# EAGLE schematic wclock (EAGLE 6.0)
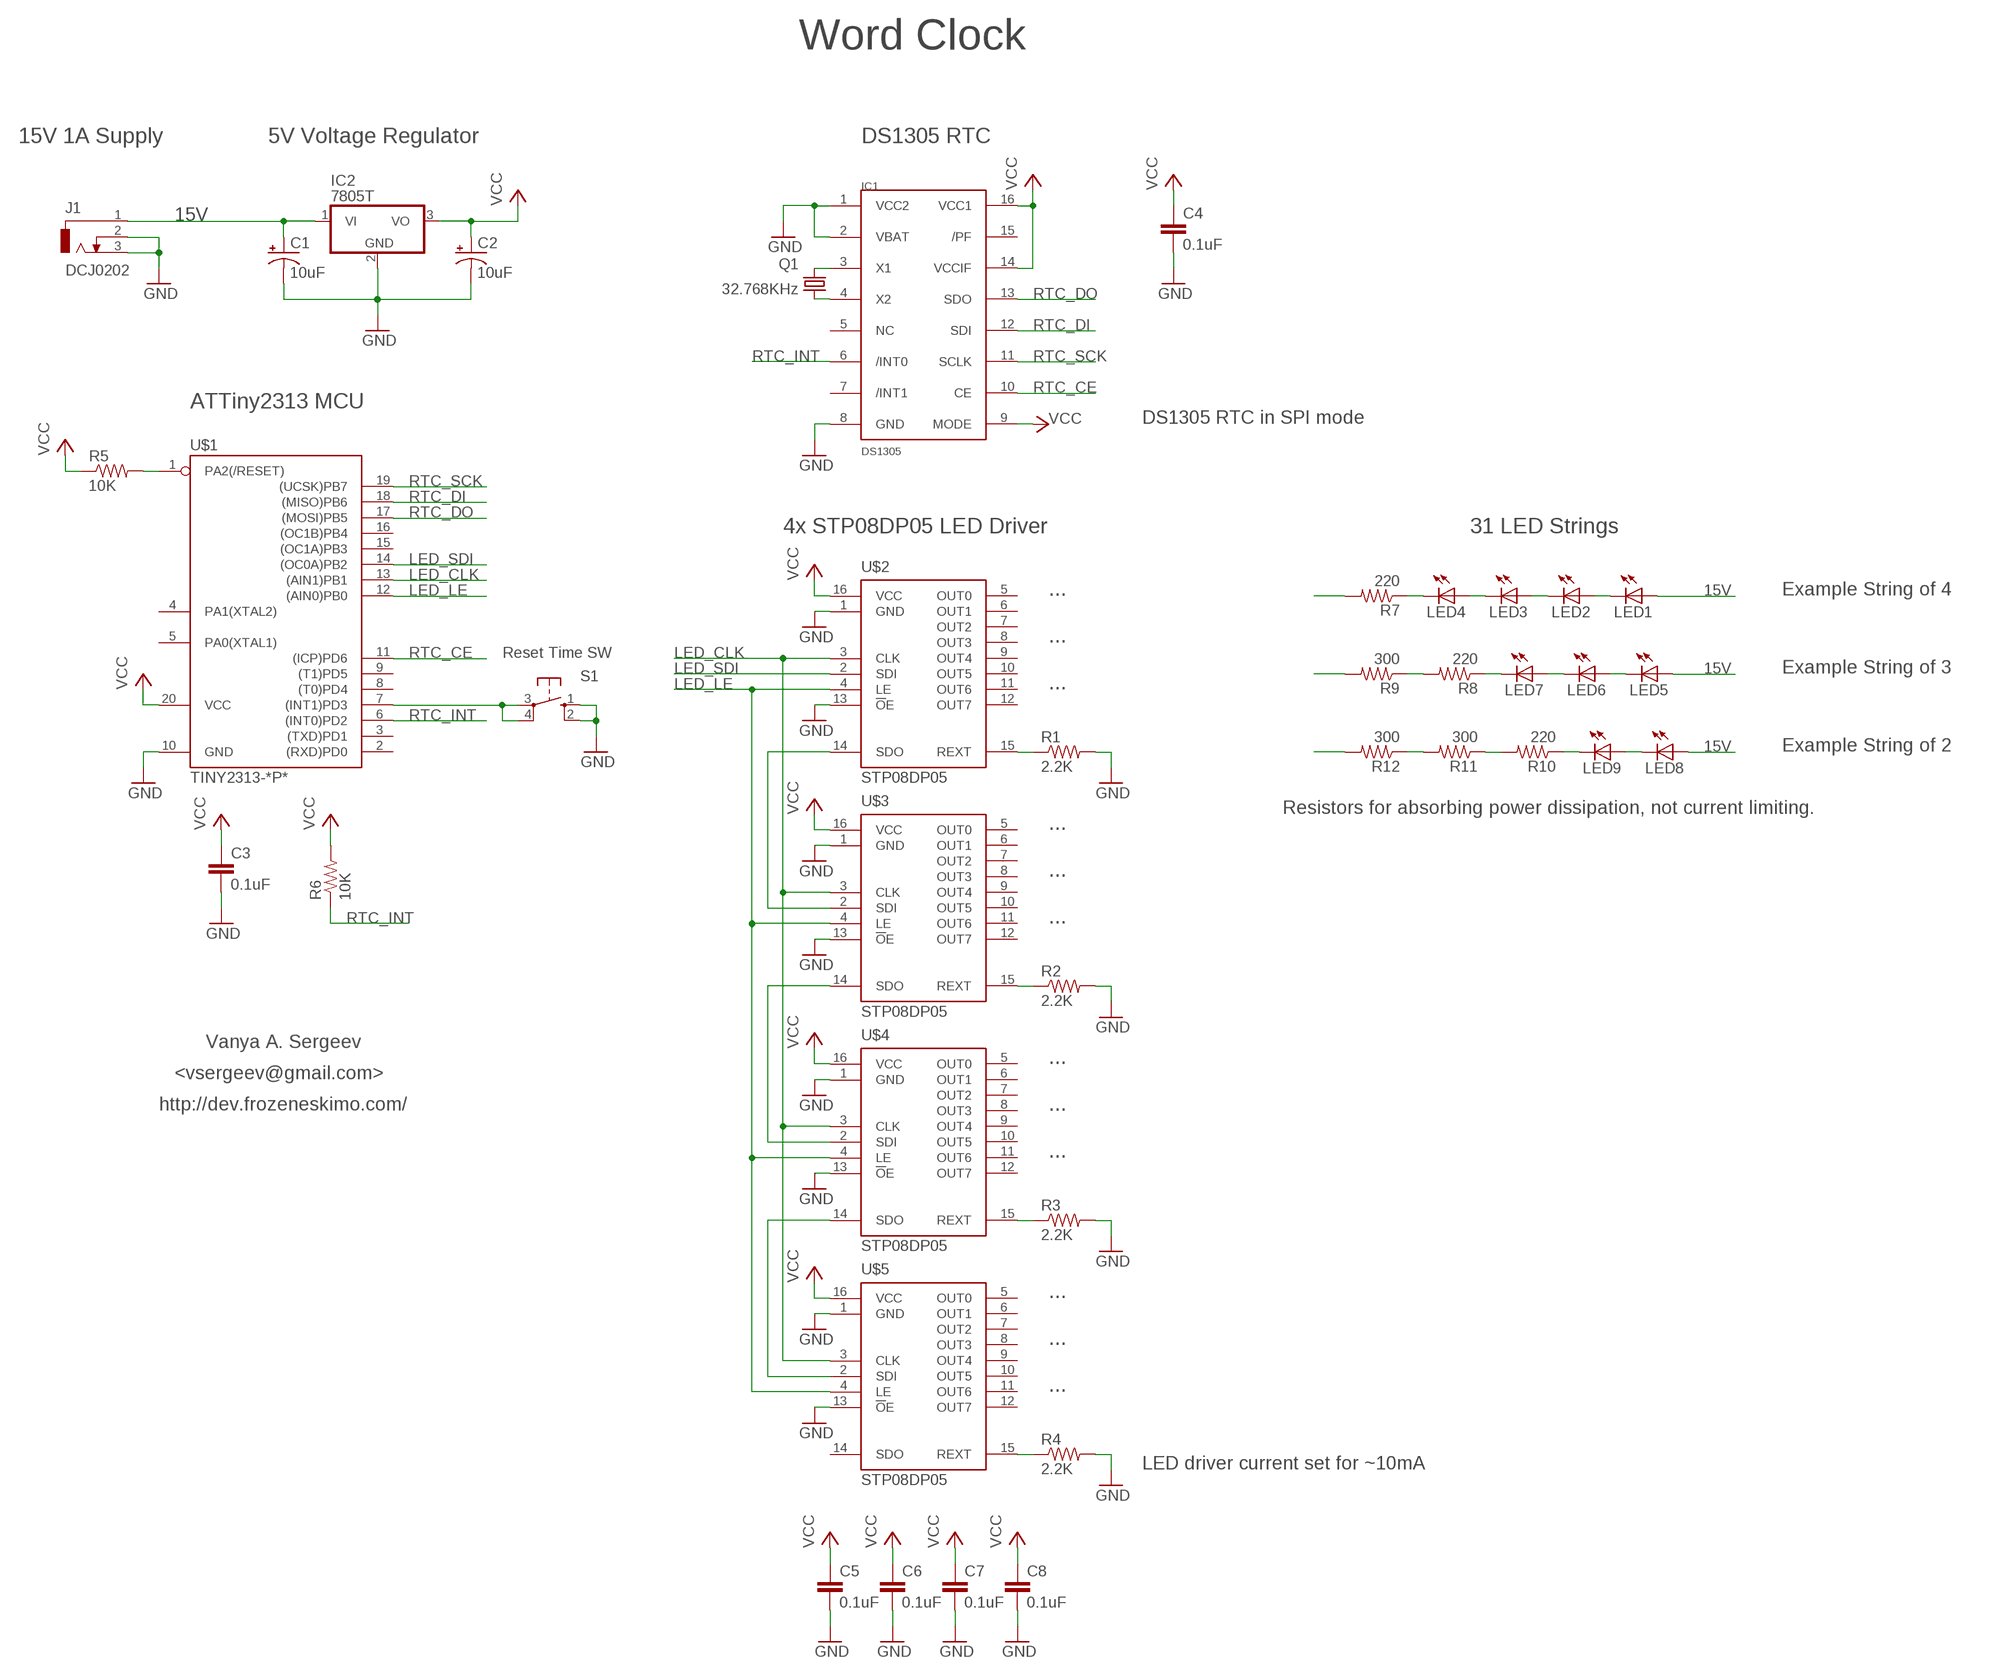
[diagram p0: schematic, sheet 1]

## Parts
C1  10uF  CPOL-USE2.5-5  [E2,5-5]
C2  10uF  CPOL-USE2.5-5  [E2,5-5]
C3  0.1uF  C-EU025-025X050  [C025-025X050]
C4  0.1uF  C-EU025-025X050  [C025-025X050]
C5  0.1uF  C-EU025-025X050  [C025-025X050]
C6  0.1uF  C-EU025-025X050  [C025-025X050]
C7  0.1uF  C-EU025-025X050  [C025-025X050]
C8  0.1uF  C-EU025-025X050  [C025-025X050]
IC1  DS1305  [DIL16]
IC2  7805T  [TO220H]
J1  DCJ0202  [DCJ0202]
LED1  LED5MM  [LED5MM]
LED2  LED5MM  [LED5MM]
LED3  LED5MM  [LED5MM]
LED4  LED5MM  [LED5MM]
LED5  LED5MM  [LED5MM]
LED6  LED5MM  [LED5MM]
LED7  LED5MM  [LED5MM]
LED8  LED5MM  [LED5MM]
LED9  LED5MM  [LED5MM]
Q1  32.768KHz  CRYSTALTC26V  [TC26V]
R1  2.2K  R-US_0207/10  [0207/10]
R2  2.2K  R-US_0207/10  [0207/10]
R3  2.2K  R-US_0207/10  [0207/10]
R4  2.2K  R-US_0207/10  [0207/10]
R5  10K  R-US_0207/10  [0207/10]
R6  10K  R-US_0207/10  [0207/10]
R7  220  R-US_0207/10  [0207/10]
R8  220  R-US_0207/10  [0207/10]
R9  300  R-US_0207/10  [0207/10]
R10  220  R-US_0207/10  [0207/10]
R11  300  R-US_0207/10  [0207/10]
R12  300  R-US_0207/10  [0207/10]
S1  10-XX  [B3F-10XX]
U$1  TINY2313-*P*  [DIL20]
U$2  STP08DP05  [DIL16]
U$3  STP08DP05  [DIL16]
U$4  STP08DP05  [DIL16]
U$5  STP08DP05  [DIL16]

## Nets
15V: C1.+ IC2.1(VI) J1.1 LED1.A LED5.A LED8.A
GND: C1.- C2.- C3.2 C4.2 C5.2 C6.2 C7.2 C8.2 IC1.1(VCC2) IC1.2(VBAT) IC1.8(GND) IC2.2(GND) J1.2 J1.3 R1.2 R2.2 R3.2 R4.2 S1.1(S) S1.2(S1) U$1.10(GND) U$2.1(GND) U$2.13(!O!E) U$3.1(GND) U$3.13(!O!E) U$4.1(GND) U$4.13(!O!E) U$5.1(GND) U$5.13(!O!E)
LED_CLK: U$1.13((AIN1)PB1) U$2.3(CLK) U$3.3(CLK) U$4.3(CLK) U$5.3(CLK)
LED_LE: U$1.12((AIN0)PB0) U$2.4(LE) U$3.4(LE) U$4.4(LE) U$5.4(LE)
LED_SDI: U$1.14((OC0A)PB2) U$2.2(SDI)
N$1: R10.2 R11.1
N$2: IC1.3(X1) Q1.2
N$3: IC1.4(X2) Q1.1
N$4: R1.1 U$2.15(REXT)
N$5: R2.1 U$3.15(REXT)
N$6: U$2.14(SDO) U$3.2(SDI)
N$7: U$3.14(SDO) U$4.2(SDI)
N$8: U$4.14(SDO) U$5.2(SDI)
N$9: R3.1 U$4.15(REXT)
N$10: R4.1 U$5.15(REXT)
N$11: R5.2 U$1.1(PA2(/RESET))
N$12: LED4.K(C) R7.1
N$13: R8.2 R9.1
N$14: R7.2
N$15: R9.2
N$16: R12.2
N$17: LED1.K(C) LED2.A
N$18: LED2.K(C) LED3.A
N$19: S1.3(P) S1.4(P1) U$1.7((INT1)PD3)
N$20: LED3.K(C) LED4.A
N$21: LED7.K(C) R8.1
N$22: LED6.K(C) LED7.A
N$23: LED5.K(C) LED6.A
N$24: LED8.K(C) LED9.A
N$25: LED9.K(C) R10.1
N$26: R11.2 R12.1
RTC_CE: IC1.10(CE) U$1.11((ICP)PD6)
RTC_DI: IC1.12(SDI) U$1.18((MISO)PB6)
RTC_DO: IC1.13(SDO) U$1.17((MOSI)PB5)
RTC_INT: IC1.6(/INT0) R6.1 U$1.6((INT0)PD2)
RTC_SCK: IC1.11(SCLK) U$1.19((UCSK)PB7)
VCC: C2.+ C3.1 C4.1 C5.1 C6.1 C7.1 C8.1 IC1.9(MODE) IC1.14(VCCIF) IC1.16(VCC1) IC2.3(VO) R5.1 R6.2 U$1.20(VCC) U$2.16(VCC) U$3.16(VCC) U$4.16(VCC) U$5.16(VCC)
Unconnected: IC1.5(NC) IC1.7(/INT1) IC1.15(/PF) U$1.2((RXD)PD0) U$1.3((TXD)PD1) U$1.4(PA1(XTAL2)) U$1.5(PA0(XTAL1)) U$1.8((T0)PD4) U$1.9((T1)PD5) U$1.15((OC1A)PB3) U$1.16((OC1B)PB4) U$2.5(OUT0) U$2.6(OUT1) U$2.7(OUT2) U$2.8(OUT3) U$2.9(OUT4) U$2.10(OUT5) U$2.11(OUT6) U$2.12(OUT7) U$3.5(OUT0) U$3.6(OUT1) U$3.7(OUT2) U$3.8(OUT3) U$3.9(OUT4) U$3.10(OUT5) U$3.11(OUT6) U$3.12(OUT7) U$4.5(OUT0) U$4.6(OUT1) U$4.7(OUT2) U$4.8(OUT3) U$4.9(OUT4) U$4.10(OUT5) U$4.11(OUT6) U$4.12(OUT7) U$5.5(OUT0) U$5.6(OUT1) U$5.7(OUT2) U$5.8(OUT3) U$5.9(OUT4) U$5.10(OUT5) U$5.11(OUT6) U$5.12(OUT7) U$5.14(SDO)

## Notes on the sheet
- Word Clock
- 15V 1A Supply | 5V Voltage Regulator | DS1305 RTC
- ATTiny2313 MCU
- DS1305 RTC in SPI mode
- 4x STP08DP05 LED Driver | 31 LED Strings
- ... | Example String of 4
- ...
- Reset Time SW
- Example String of 3
- ...
- Example String of 2
- Resistors for absorbing power dissipation, not current limiting.
- ...
- ...
- ...
- Vanya A. Sergeev
- ...
- <vsergeev@gmail.com>
- http://dev.frozeneskimo.com/ | ...
- ...
- ...
- ...
- ...
- LED driver current set for ~10mA

## Library data of the parts
C1 C2 = rcl:CPOL-US: POLARIZED CAPACITOR, American symbol
C3-C8 = rcl:C-EU: CAPACITOR, European symbol
IC1 = dallas-rtc:DS1305: Serial Alarm Real-Time Clock
IC2 = linear:78*: Positive VOLTAGE REGULATOR Source: http://cache.national.com/ds/LM/LM78L05.pdf http://www.fairchildsemi.com/ds/LM/LM7805.pdf
J1 = con-jack:DCJ0202: DC POWER JACK Source: DCJ0202.pdf; OC_FARNELL: unknown; OC_NEWARK: unknown
LED1-LED9 = led:LED: LED OSRAM: - CHIPLED LG R971, LG N971, LY N971, LG Q971, LY Q971, LO R971, LY R971 LH N974, LH R974 LS Q976, LO Q976, LY Q976 LO Q996 - Hyper CHIPLED LW Q18S LB Q993, LB Q99A, LB R99A - SideLED LS A670, LO A670, LY A670, LG A670, LP A670 LB A673, LV A673, LT A673, LW A673 LH A674 LY A675 LS A676, LA A676, LO A676, LY A676, LW A676 LS A679, LY A679, LG A679 - Hyper Micro SIDELED® LS Y876, LA Y876, LO Y876, LY Y876 LT Y87S - SmartLED LW L88C, LW L88S LB L89C, LB L89S, LG L890 LS L89K, LO L89K, LY L89K LS L896, LA L896, LO L896, LY L896 - TOPLED LS T670, LO T670, LY T670, LG T670, LP T670 LSG T670, LSP T670, LSY T670, LOP T670, LYG T670 LG T671, LOG T671, LSG T671 LB T673, LV T673, LT T673, LW T673 LH T674 LS T676, LA T676, LO T676, LY T676, LB T676, LH T676, LSB T676, LW T676 LB T67C, LV T67C, LT T67C, LS T67K, LO T67K, LY T67K, LW E67C LS E67B, LA E67B, LO E67B, LY E67B, LB E67C, LV E67C, LT E67C LW T67C LS T679, LY T679, LG T679 LS T770, LO T770, LY T770, LG T770, LP T770 LB T773, LV T773, LT T773, LW T773 LH T774 LS E675, LA E675, LY E675, LS T675 LS T776, LA T776, LO T776, LY T776, LB T776 LHGB T686 LT T68C, LB T68C - Hyper Mini TOPLED® LB M676 - Mini TOPLED Santana® LG M470 LS M47K, LO M47K, LY M47K Source: http://www.osram.convergy.de LUXEON: - LUMILED® LXK2-PW12-R00, LXK2-PW12-S00, LXK2-PW14-U00, LXK2-PW14-V00 LXK2-PM12-R00, LXK2-PM12-S00, LXK2-PM14-U00 LXK2-PE12-Q00, LXK2-PE12-R00, LXK2-PE12-S00, LXK2-PE14-T00, LXK2-PE14-U00 LXK2-PB12-K00, LXK2-PB12-L00, LXK2-PB12-M00, LXK2-PB14-N00, LXK2-PB14-P00, LXK2-PB14-Q00 LXK2-PR12-L00, LXK2-PR12-M00, LXK2-PR14-Q00, LXK2-PR14-R00 LXK2-PD12-Q00, LXK2-PD12-R00, LXK2-PD12-S00 LXK2-PH12-R00, LXK2-PH12-S00 LXK2-PL12-P00, LXK2-PL12-Q00, LXK2-PL12-R00 Source: www.luxeon.com KINGBRIGHT: KA-3528ASYC Source: www.kingbright.com
Q1 = crystal:CRYSTAL: CRYSTAL; OC_FARNELL: unknown; OC_NEWARK: unknown
R1-R12 = rcl:R-US_: RESISTOR, American symbol
S1 = switch-omron:10-XX: OMRON SWITCH; MPN: B3F-1000; OC_FARNELL: 176432; OC_NEWARK: 36M3542
U$1 = avr-7:TINY2313*: Atmel Tiny2313 2K Flash, 128 bytes EEPROM, 128 bytes RAM
U$2-U$5 = ivan:STP08DP05